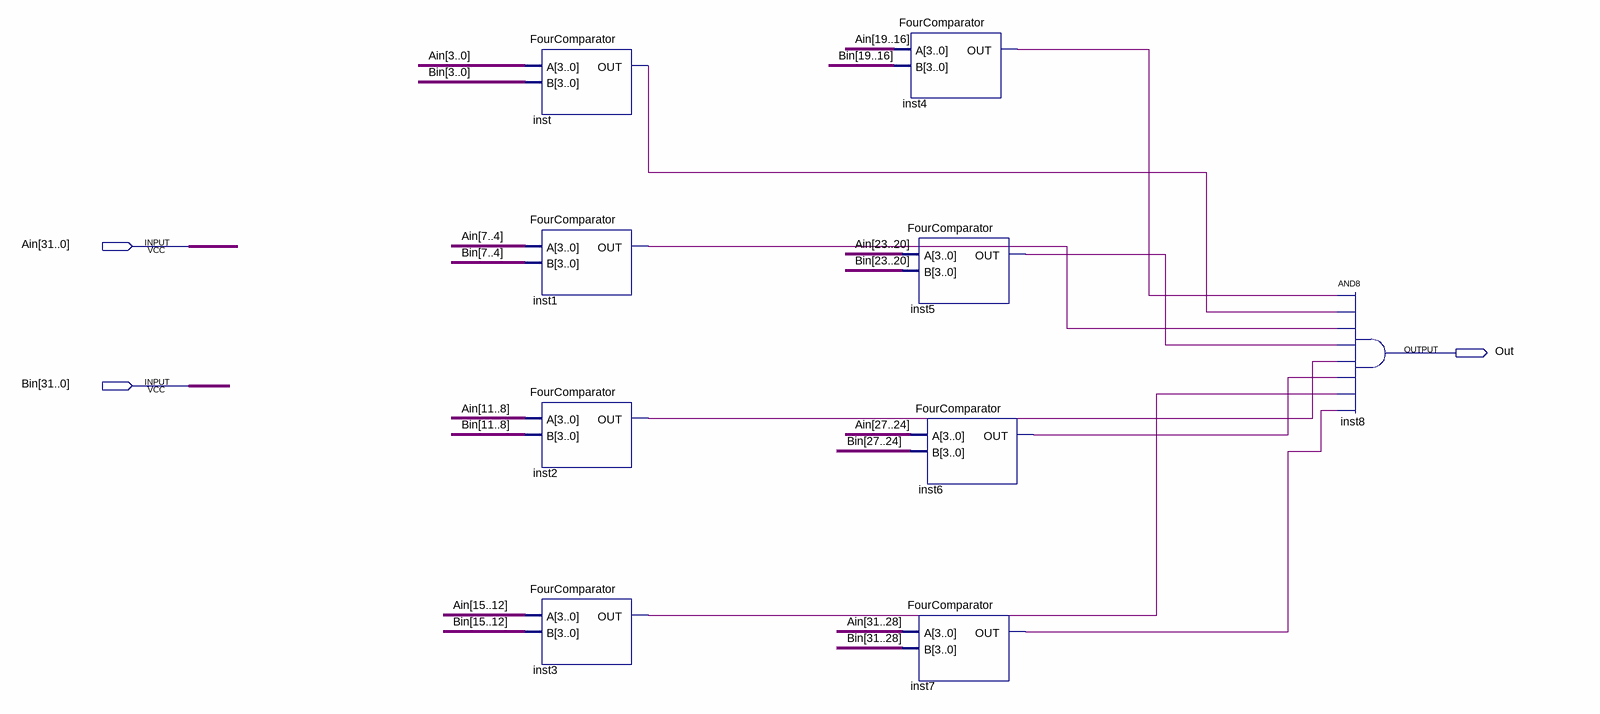
[diagram p0: schematic sheet]
// Quartus schematic ThirtytwoComparator.bdf as structural Verilog: 9 symbols, 3 pins
module ThirtytwoComparator (
  input  [31:0] Ain,
  input  [31:0] Bin,
  output Out
);

  wire inst1_out, inst2_out, inst3_out, inst4_out, inst5_out, inst6_out, inst7_out, inst_out;

  FourComparator inst (.A(Ain[3:0]), .B(Bin[3:0]), .OUT(inst_out));
  FourComparator inst1 (.A(Ain[7:4]), .B(Bin[7:4]), .OUT(inst1_out));
  FourComparator inst2 (.A(Ain[11:8]), .B(Bin[11:8]), .OUT(inst2_out));
  FourComparator inst3 (.A(Ain[15:12]), .B(Bin[15:12]), .OUT(inst3_out));
  FourComparator inst4 (.A(Ain[19:16]), .B(Bin[19:16]), .OUT(inst4_out));
  FourComparator inst5 (.A(Ain[23:20]), .B(Bin[23:20]), .OUT(inst5_out));
  FourComparator inst6 (.A(Ain[27:24]), .B(Bin[27:24]), .OUT(inst6_out));
  FourComparator inst7 (.A(Ain[31:28]), .B(Bin[31:28]), .OUT(inst7_out));
  and inst8 (Out, inst4_out, inst_out, inst1_out, inst5_out, inst2_out, inst6_out, inst3_out, inst7_out);
endmodule
